# Altium project JoyStick Module.PrjPcb
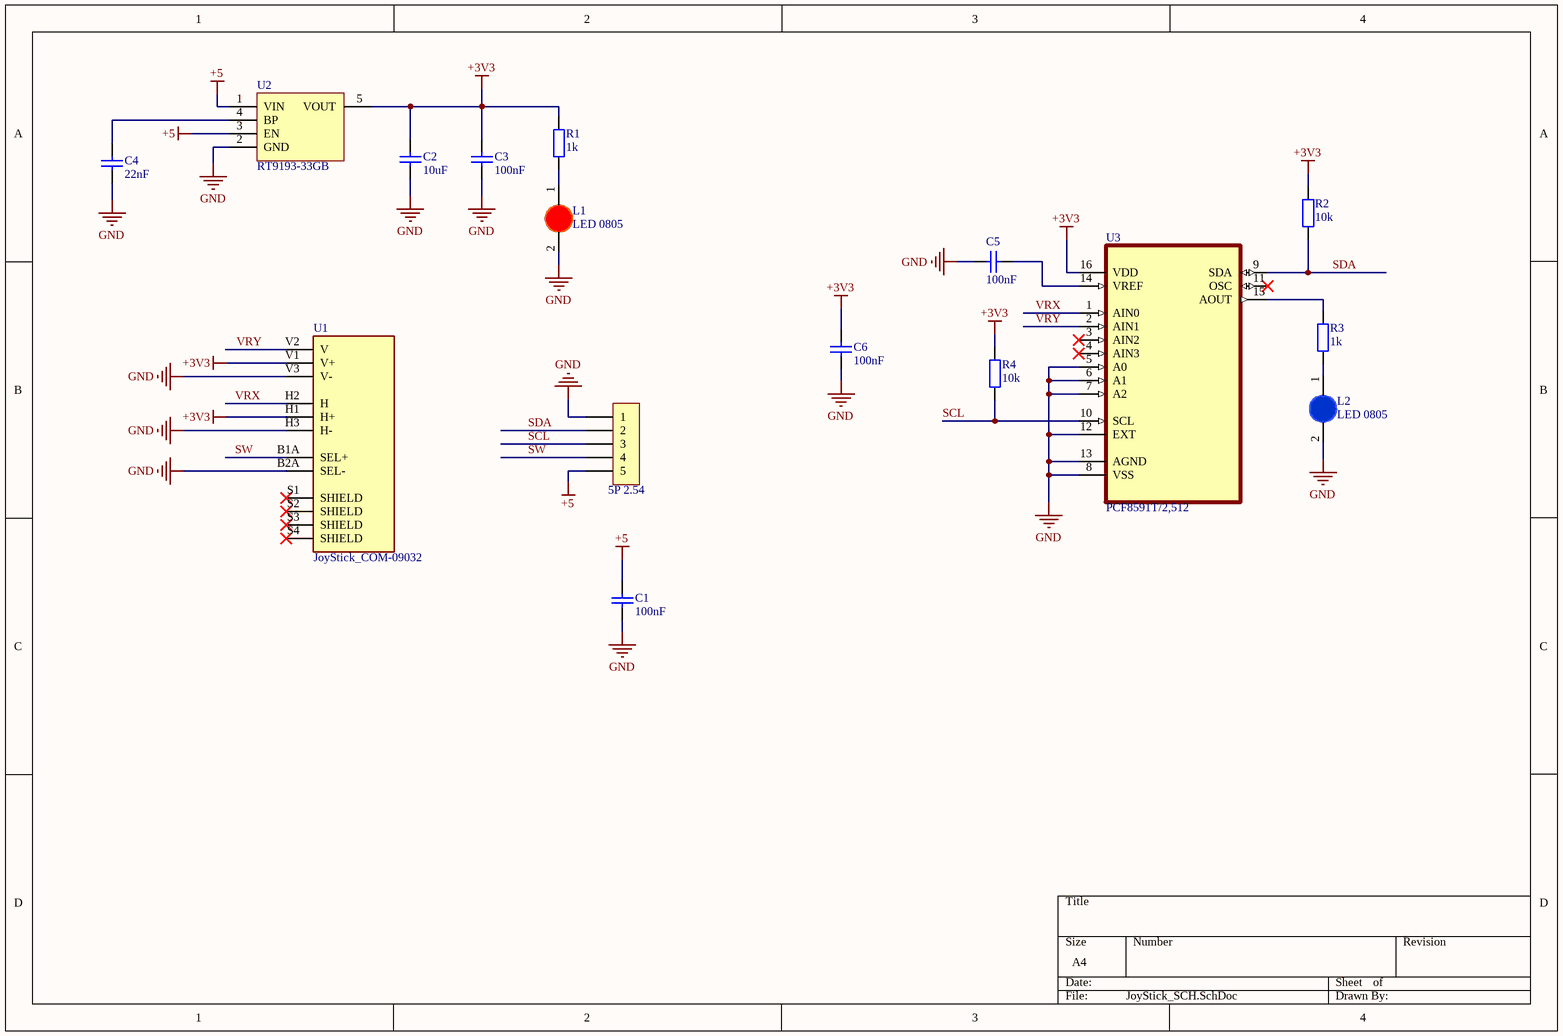
[diagram p0: JoyStick_SCH.SchDoc]
1 sheet, 16 parts. Net scope: global (net labels, ports and power ports of the same name join across sheets).
Board file: JoyStick_PCB.PcbDoc

## Sheet JoyStick_SCH.SchDoc
size A4; SheetNumber: 1; SheetTotal: 1

### Parts
C1  100nF  [tu 0603]
C2  10uF  [tu 0603]
C3  100nF  [tu 0603]
C4  22nF  [tu 0603]
C5  100nF  [tu 0603]
C6  100nF  [tu 0603]
H1  5P 2.54  [Header 5P DC 2.54]
L1  LED 0805  [LED-0805-Red]
L2  LED 0805  [LED-0805-Blue]
R1  1k  [tro smd 0603]
R2  10k  [tro smd 0603]
R3  1k  [tro smd 0603]
R4  10k  [tro smd 0603]
U1  JoyStick_COM-09032  [XDCR_COM-09032]
U2  RT9193-33GB  [SOT23-5]
U3  PCF8591T/2,512  [SOIC127P1032X265-16N]

### Nets
+3V3: C2.1 C3.1 C6.1 R1.2 R2.2 R4.2 U1.H1(H+) U1.V1(V+) U2.5(VOUT) U3.16(VDD)
+5: C1.1 H1.5 U2.1(VIN) U2.3(EN)
GND: C1.2 C2.2 C3.2 C4.2 C5.2 C6.2 H1.1 L1.2(K) L2.2(K) U1.B2A(SEL-) U1.H3(H-) U1.V3(V-) U2.2(GND) U3.5(A0) U3.6(A1) U3.7(A2) U3.8(VSS) U3.12(EXT) U3.13(AGND)
SCL: H1.3 R4.1 U3.10(SCL)
SDA: H1.2 R2.1 U3.9(SDA)
SW: H1.4 U1.B1A(SEL+)
VRX: U1.H2(H) U3.1(AIN0)
VRY: U1.V2(V) U3.2(AIN1)
NetC4_1: C4.1 U2.4(BP)
NetC5_1: C5.1 U3.14(VREF)
NetL1_1: L1.1(A) R1.1
NetL2_1: L2.1(A) R3.1
NetR3_2: R3.2 U3.15(AOUT)

Not connected (* = marked no-connect by the designer): U1 S1(SHIELD)* S2(SHIELD)* S3(SHIELD)* S4(SHIELD)*; U3 3(AIN2)* 4(AIN3)* 11(OSC)*

### Library data of the parts
C1 C3-C6 = Tu 0603 104 50V 10%: Dán; Don_Vi: Con; So_Chan: 2; Ten_Linh_Kien: Tụ 0603 104-100nF 10% 50V; Ma_Hang: MH004568; Chung_Loai: Dán; Kieu_Chan: *
C2 = Tu 0603 106 16V 20%: Dán; Don_Vi: Con; So_Chan: 2; Ten_Linh_Kien: Tụ 0603-10uF 20% 16V; Ma_Hang: MH004848; Chung_Loai: Dán; Kieu_Chan: *
H1 = Header 5P 2.54 Duc Cong: Cắm; Ten_Linh_Kien: Header 5P XH2.54-5P Đực Cong; Don_Vi: Con; Ma_Hang: MH001308; Chung_Loai: Cắm
L1 = LED 0805 Do: Dán; Don_Vi: Con; Ma_Hang: MH000897; Ten_Linh_Kien: LED 0805 Màu Đỏ (Red); Ghi_Chu: *; Kieu_Chan: *; Chung_Loai: Dán
L2 = LED 0805 Xanh Duong: Dán; Don_Vi: Con; Ma_Hang: MH002327; Ten_Linh_Kien: LED 0805 Màu Xanh Dương (Blue); Ghi_Chu: *; Kieu_Chan: *; Chung_Loai: Dán
R1 R3 = Tro 0603 1% 1k: Dán; So_Chan: 2; Don_Vi: Con; Ten_Linh_Kien: Trở 0603 1% 1k; Ma_Hang: MH006334; Chung_Loai: Dán; Kieu_Chan: *
R2 R4 = Tro 0603 1% 10k: Dán; Don_Vi: Con; So_Chan: 2; Ten_Linh_Kien: Trở 0603 1% 10k; Ma_Hang: MH006333; Chung_Loai: Dán; Kieu_Chan: *
U1 = JoyStick_COM-09032: Thumb Joystick; Price: None; Availability: Unavailable; MP: COM-09032; Value: *; Package: None
U2 = REG_5.5V-3.3V-0.3A-1W-SOT-23-5: Linear Voltage Regulator IC 1 Output 300mA SOT-23-5; Manufacturer: Richtek USA Inc.; Alternate Part Number-1: NA; Manufacturer Part Number: RT9193-33GB; Supplier-1: LCSC; Supplier Part Number-1: C15651; Case/Package: SOT-23-5
U3 = PCF8591T/2,512: ADC, DAC 8 b 11.1k I2C, Serial 16-SO; MF: NXP USA; SnapEDA_Link: https://www.snapeda.com/parts/PCF8591T/2,512/NXP+Semiconductors/view-part/?ref=snap; Package: SOIC-16 NXP Semiconductors; Value: *; MP: PCF8591T/2,512; Check_prices: https://www.snapeda.com/parts/PCF8591T/2,512/NXP+Semiconductors/view-part/?ref=eda